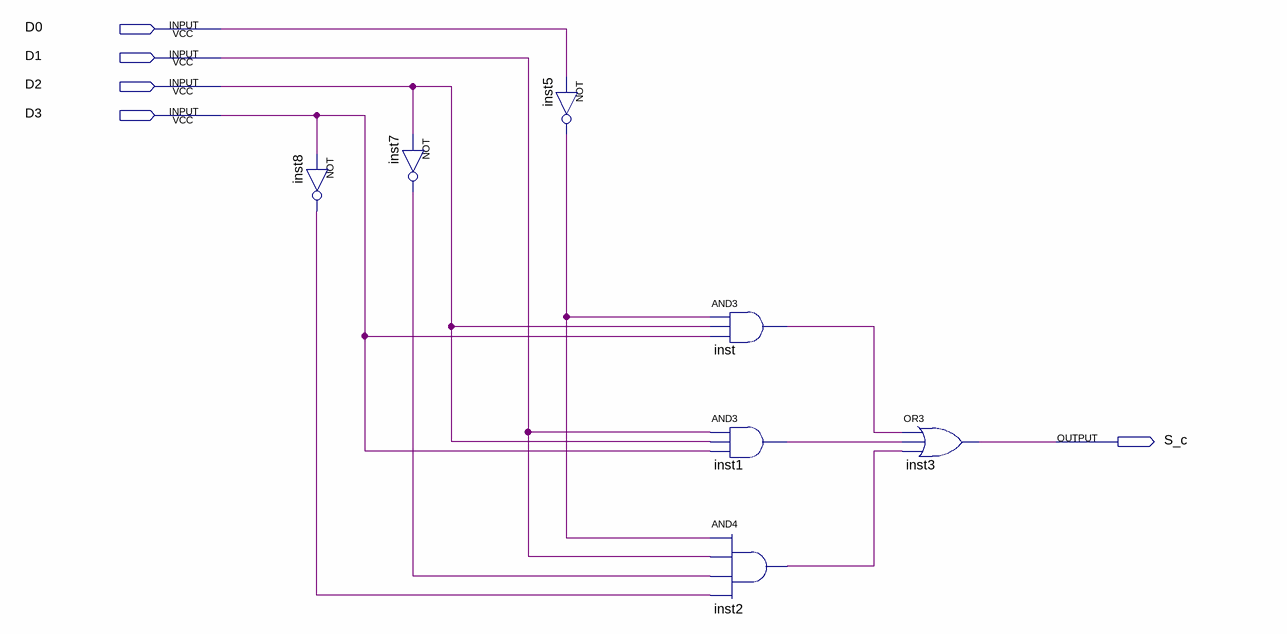
[diagram p0: schematic sheet]
// Quartus schematic S_c.bdf as structural Verilog: 7 symbols, 5 pins
module S_c (
  input  D0,
  input  D1,
  input  D2,
  input  D3,
  output S_c
);

  wire inst1_out, inst2_out, inst5_out, inst7_out, inst8_out, inst_out;

  not inst8 (inst8_out, D3);
  not inst7 (inst7_out, D2);
  not inst5 (inst5_out, D0);
  and inst (inst_out, inst5_out, D2, D3);
  and inst1 (inst1_out, D1, D2, D3);
  and inst2 (inst2_out, inst5_out, D1, inst7_out, inst8_out);
  or inst3 (S_c, inst_out, inst1_out, inst2_out);
endmodule
